# EAGLE design GPIO BOARD (EAGLE 7.4.0)
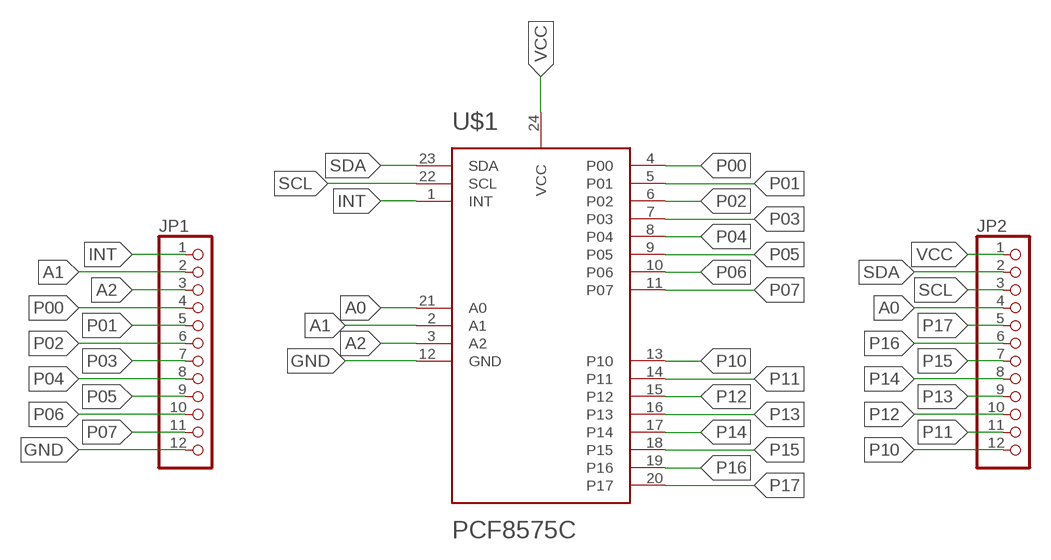
[diagram p0: schematic, sheet 1]

## Parts
JP1  PINHD-1X12  [1X12]
JP2  PINHD-1X12  [1X12]
U$1  PCF8575C  [PCF8575C]

## Nets
A0: JP2.4 U$1.21(A0)
A1: JP1.2 U$1.2(A1)
A2: JP1.3 U$1.3(A2)
GND: JP1.12 U$1.12(GND)
INT: JP1.1 U$1.1(INT)
P00: JP1.4 U$1.4(P00)
P01: JP1.5 U$1.5(P01)
P02: JP1.6 U$1.6(P02)
P03: JP1.7 U$1.7(P03)
P04: JP1.8 U$1.8(P04)
P05: JP1.9 U$1.9(P05)
P06: JP1.10 U$1.10(P06)
P07: JP1.11 U$1.11(P07)
P10: JP2.12 U$1.13(P10)
P11: JP2.11 U$1.14(P11)
P12: JP2.10 U$1.15(P12)
P13: JP2.9 U$1.16(P13)
P14: JP2.8 U$1.17(P14)
P15: JP2.7 U$1.18(P15)
P16: JP2.6 U$1.19(P16)
P17: JP2.5 U$1.20(P17)
SCL: JP2.3 U$1.22(SCL)
SDA: JP2.2 U$1.23(SDA)
VCC: JP2.1 U$1.24(VCC)

## Library data of the parts
JP1 JP2 = pinhead:PINHD-1X12: PIN HEADER
U$1 = NXP:PCF8575C

## Board
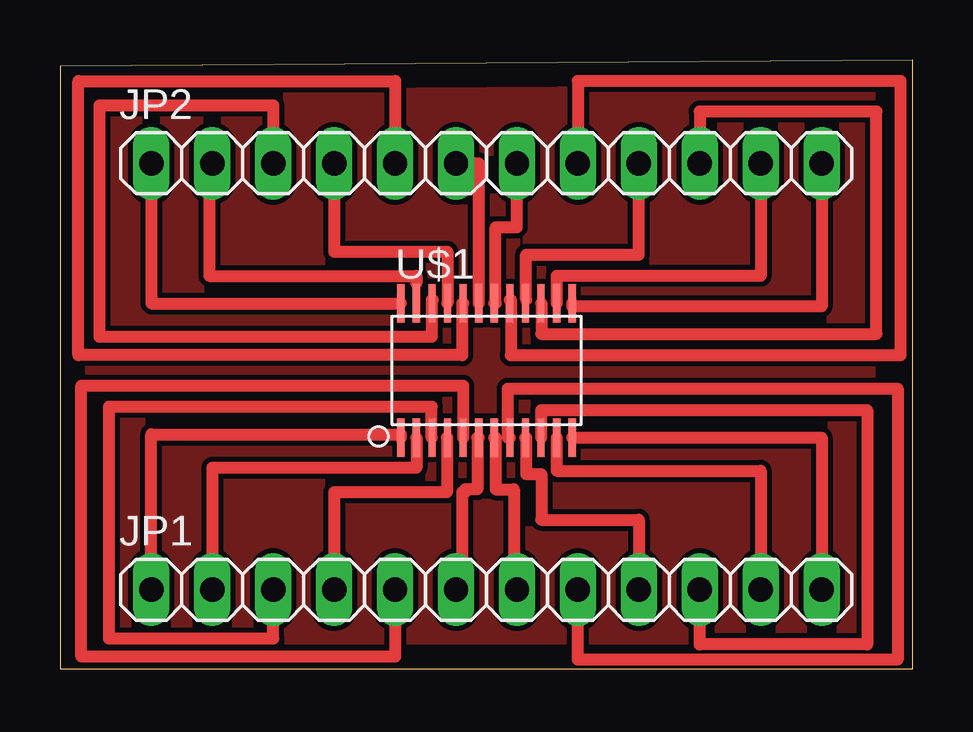
[diagram p1: board, top side]

Size 35.56 x 25.39 mm. Coordinates in mm from the lower left corner, seen from the top.
Outline: 0,0 35.56,0 35.56,25.39 0,25.14 0,0
Copper layers (1*16): Top 0.035mm / dielectric 1.5mm / Bottom 0.035mm
Design rules "default": minimum track width 10mil, minimum drill 24mil, track to track 8mil, track to pad 8mil, pad to pad 8mil, via to via 8mil, smd to smd 8mil, copper to edge 40mil, drill to drill 8mil, minimum pad ring 10mil, minimum via ring 8mil, stop-mask expansion 4mil, vias tented up to drill 0mil, thermal gap 10mil

### Footprints (pad centres in the part's own frame; a part is rotated, then mirrored left to right if it is on the bottom)
1X12 = drill 1.016 long: 1 -13.97,0; 2 -11.43,0; 3 -8.89,0; 4 -6.35,0; 5 -3.81,0; 6 -1.27,0; 7 1.27,0; 8 3.81,0; 9 6.35,0; 10 8.89,0; 11 11.43,0; 12 13.97,0
PCF8575C = smd 0.3 x 1.6: 1 -3.575,-2.8; 2 -2.925,-2.8; 3 -2.275,-2.8; 4 -1.625,-2.8; 5 -0.975,-2.8; 6 -0.325,-2.8; 7 0.325,-2.8; 8 0.975,-2.8; 9 1.625,-2.8; 10 2.275,-2.8; 11 2.925,-2.8; 12 3.575,-2.8; 13 3.575,2.8; 14 2.925,2.8; 15 2.275,2.8; 16 1.625,2.8; 17 0.975,2.8; 18 0.325,2.8; 19 -0.325,2.8; 20 -0.975,2.8; 21 -1.625,2.8; 22 -2.275,2.8; 23 -2.925,2.8; 24 -3.575,2.8

### Placement (x,y rotation side)
JP1  17.78,3.3 0 top
JP2  17.78,21.08 0 top
U$1  17.78,12.45 0 top

### Tracks (layer width: path | path; a pad name or v marks a point on that pad's centre or on a via)
A0
  Top 0.508: JP2.4 11.43,17.4 16.16,17.4 U$1.21
A1
  Top 0.508: U$1.2 14.86,8.38 6.35,8.38 JP1.2
A2
  Top 0.508: U$1.3 15.49,9.65 15.49,10.92 2.03,10.92 2.03,1.27 8.89,1.27 JP1.3
GND
  Top 0.508: U$1.12 31.75,9.65 JP1.12
INT
  Top 0.508: JP1.1 3.81,9.78 14.21,9.78 U$1.1
N$1
  pour Top: 0.13,25.27 33.78,25.27 33.78,0.64 0.13,0.64
P00
  Top 0.508: U$1.4 16.13,9.65 16.13,7.37 11.43,7.37 JP1.4
P01
  Top 0.508: JP1.5 13.97,0.51 0.89,0.51 0.89,11.81 16.8,11.81 U$1.5
P02
  Top 0.508: U$1.6 17.4,9.65 17.4,7.49 16.89,7.49 16.89,7.37 16.76,7.37 16.76,4.19 16.51,4.19 JP1.6
P03
  Top 0.508: U$1.7 18.16,9.65 18.16,7.49 18.92,7.49 18.92,3.94 | 18.92,3.81 18.92,3.94 | 18.92,3.94 19.05,3.94 JP1.7
P04
  Top 0.508: U$1.8 18.67,9.65 18.67,11.68 34.92,11.68 34.92,0.38 21.59,0.38 JP1.8
P05
  Top 0.508: U$1.9 19.43,9.65 19.43,8.13 20.07,8.13 20.07,6.22 24.13,6.22 JP1.9
P06
  Top 0.508: U$1.10 20.07,9.65 20.07,10.79 33.66,10.79 33.66,1.02 26.67,1.02 JP1.10
P07
  Top 0.508: U$1.11 20.7,8.26 29.21,8.26 JP1.11
P10
  Top 0.508: JP2.12 31.75,15.11 21.36,15.11 U$1.13
P11
  Top 0.508: JP2.11 29.21,16.38 20.7,16.38 U$1.14
P12
  Top 0.508: U$1.15 20.07,15.25 20.07,13.97 34.04,13.97 34.04,23.24 26.67,23.24 JP2.10
P13
  Top 0.254: 19.43,15.39 U$1.16 | 24,20.88 JP2.9
  Top 0.508: 19.43,15.39 19.43,17.27 24.13,17.27 JP2.9
P14
  Top 0.254: 18.75,15.39 U$1.17 | 21.49,20.88 JP2.8
  Top 0.508: 18.75,15.39 18.8,15.39 18.8,13.08 35.05,13.08 35.05,24.51 21.59,24.51 JP2.8
P15
  Top 0.508: U$1.18 18.16,15.25 18.16,18.41 19.05,18.41 19.05,19.81 19.05,19.94 JP2.7
P16
  Top 0.508: JP2.6 17.45,21.08 U$1.19
P17
  Top 0.508: U$1.20 16.76,15.25 16.76,13.08 0.76,13.08 0.76,24.51 13.97,24.51 JP2.5
SCL
  Top 0.254: 15.54,15.39 U$1.22 | 8.91,20.88 JP2.3
  Top 0.508: 15.54,15.39 15.49,15.39 15.49,13.84 1.65,13.84 1.65,23.5 8.89,23.5 JP2.3
SDA
  Top 0.254: 14.86,16.08 14.86,15.39 U$1.23 | 6.4,20.88 JP2.2
  Top 0.508: 6.4,20.88 6.22,20.88 6.22,16.38 14.86,16.38 14.86,16.08
VCC
  Top 0.254: 14.17,15.39 U$1.24 | 3.89,20.88 JP2.1
  Top 0.508: 3.89,20.88 3.81,20.88 3.81,15.24 U$1.24